# Altium schematic sheet 14-TestFixture.SchDoc: Test Fixture
size A2; Date: 26/12/2023; DocumentNumber: 14; SheetNumber: 14; SheetTotal: 15; SPICEModelCacheUDWTZYBE: <root> / <DocumentId>UDWTZYBE</DocumentId> / </root>
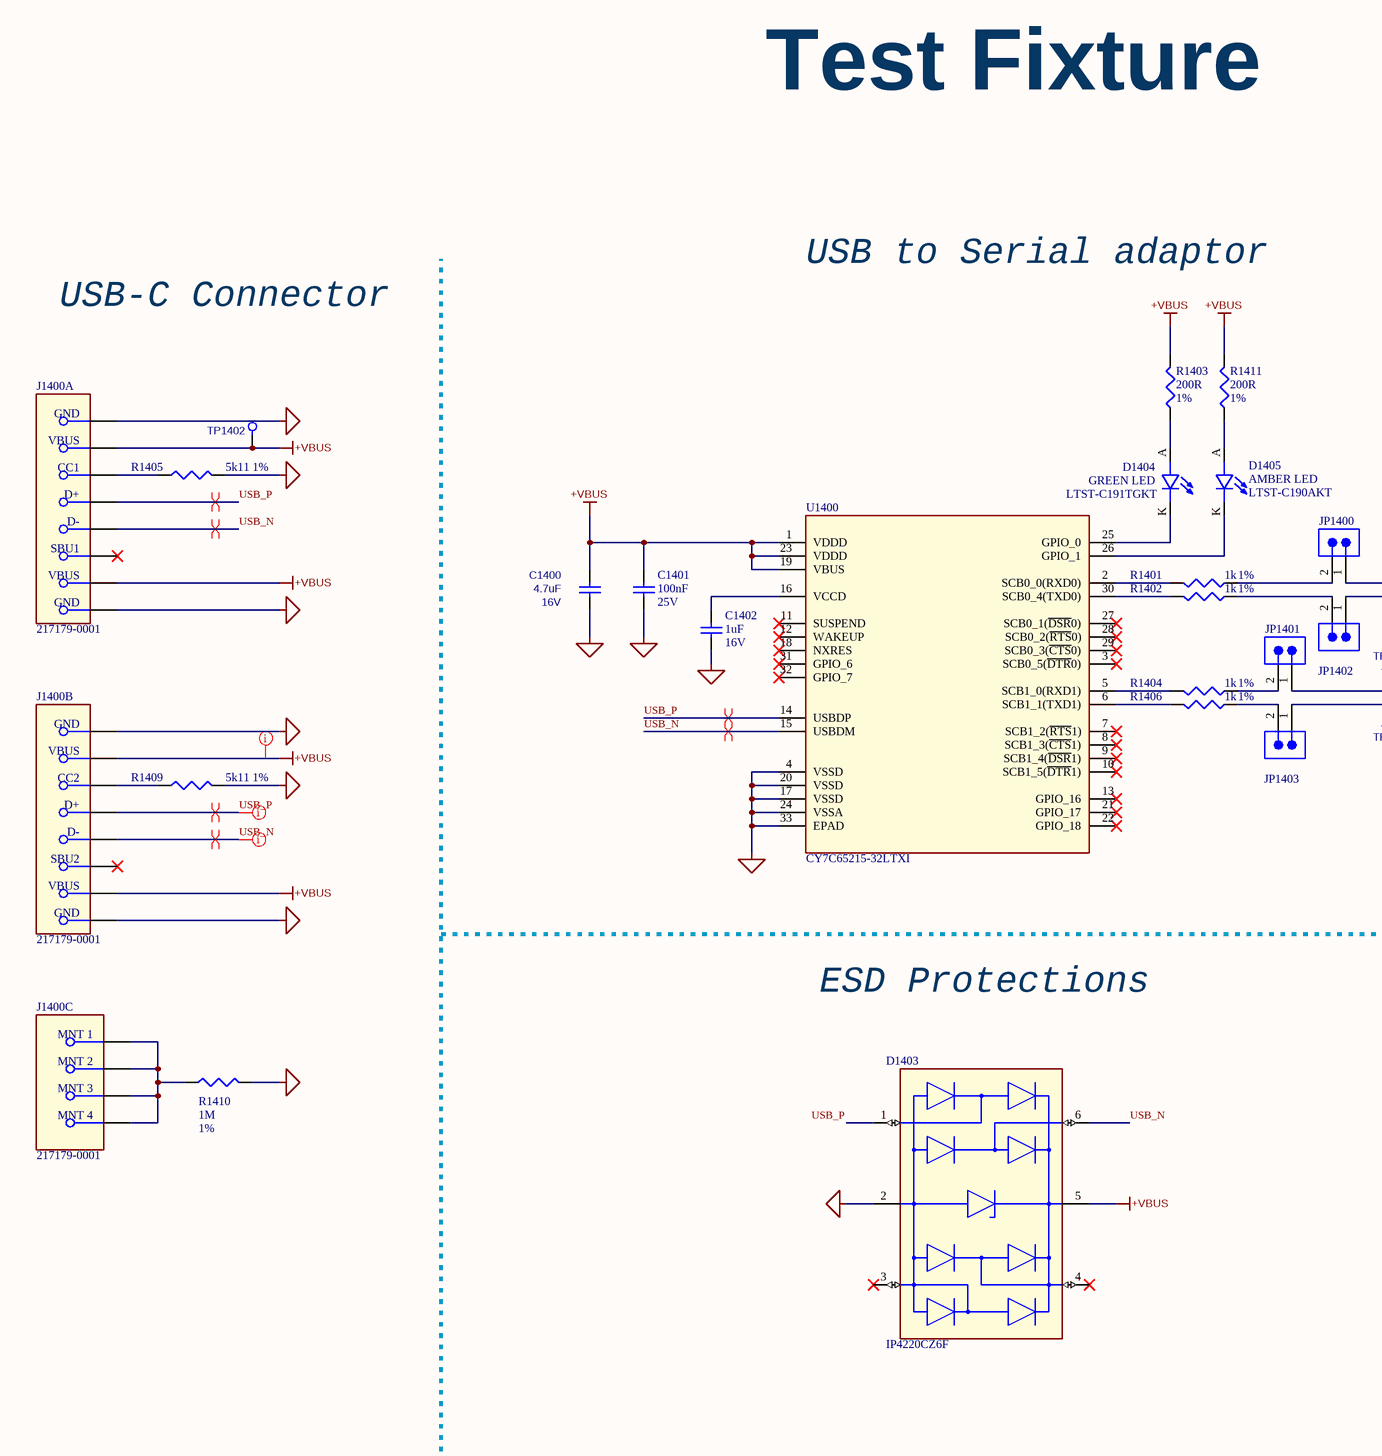
[diagram p0: 14-TestFixture.SchDoc, left]
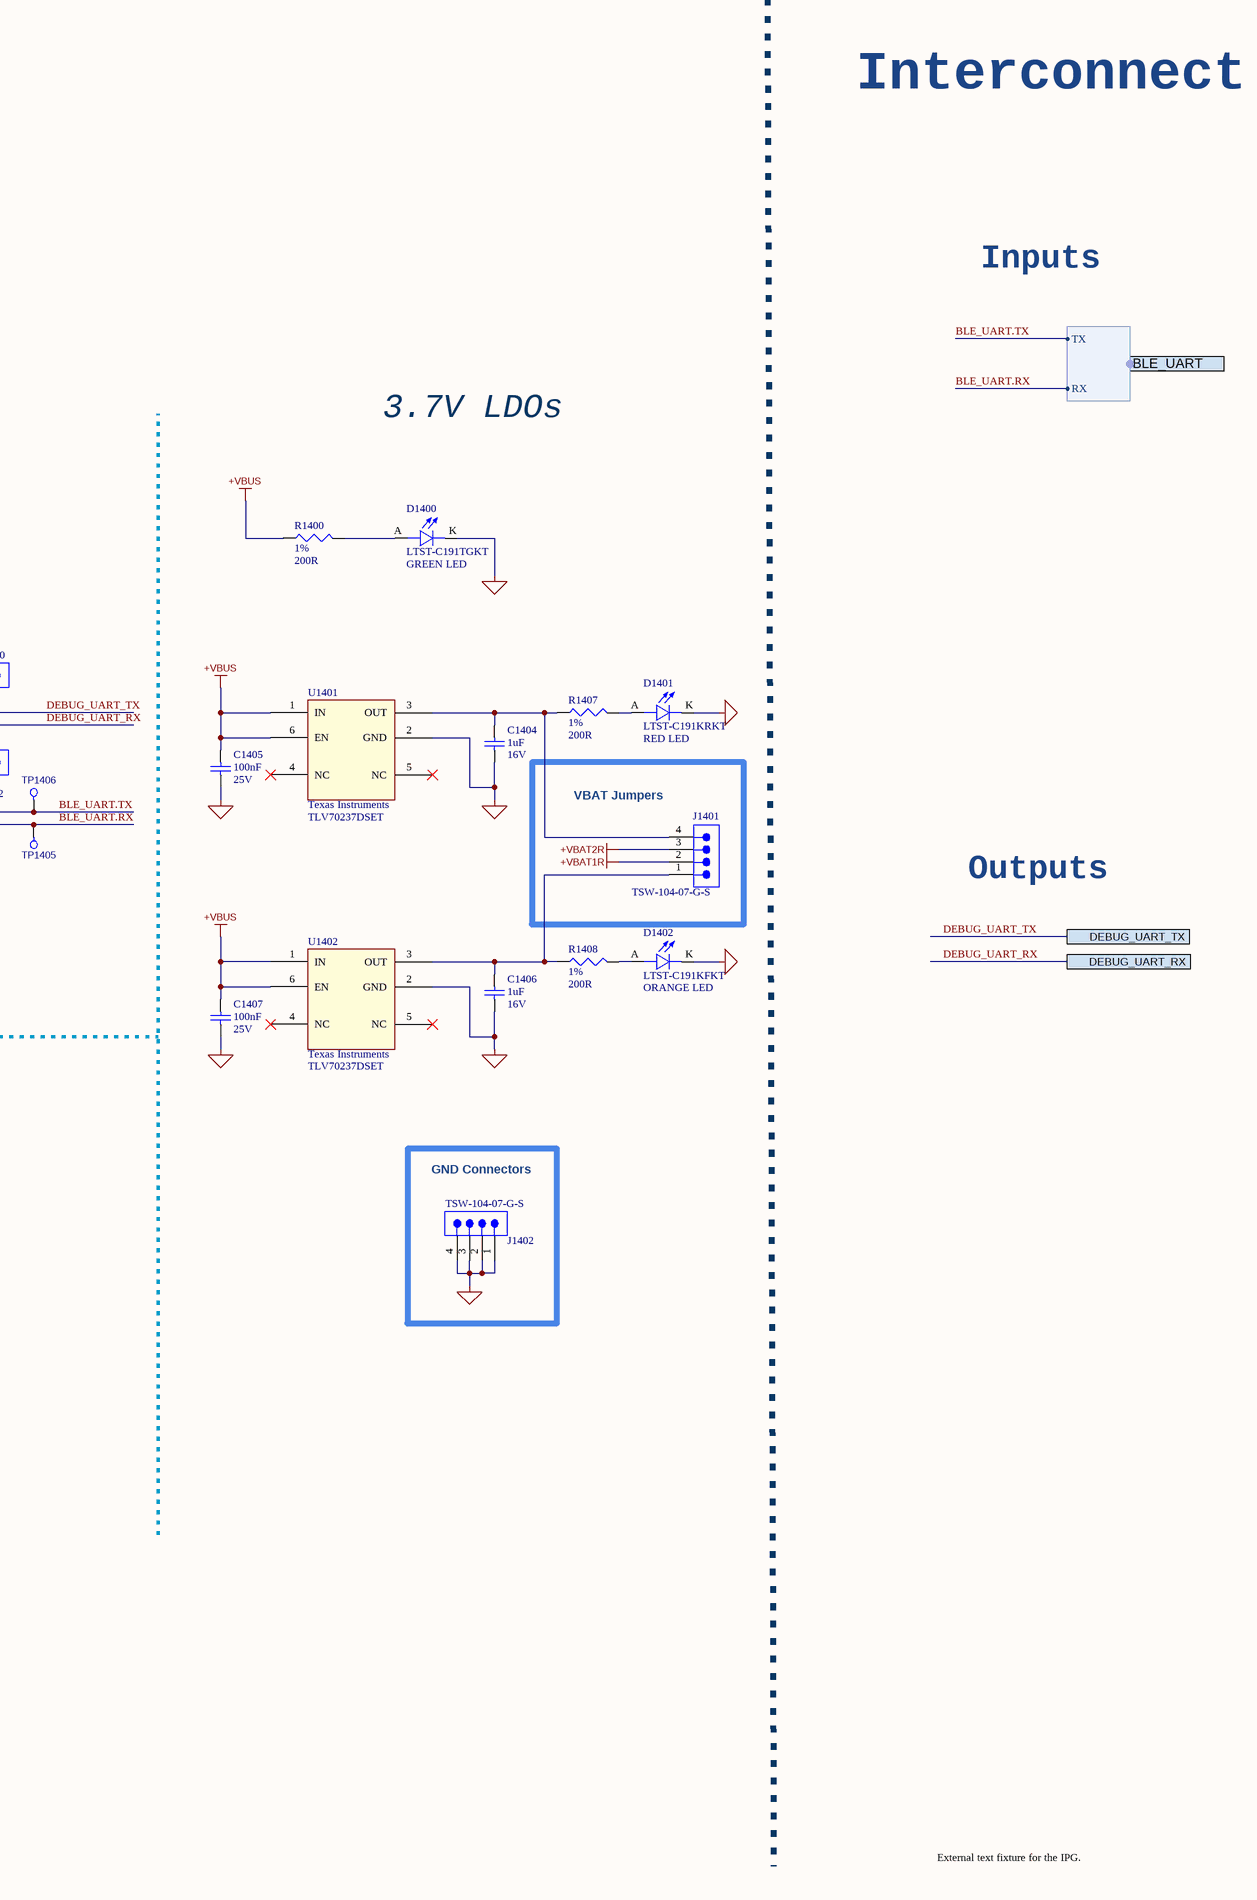
[diagram p1: 14-TestFixture.SchDoc, right]

## Parts
C1400  value 4.7uF  Rating: 16V  [CAP0603_REDUCED]  (hidden comment: GRM188R61C475KE11)
C1401  value 100nF  Rated DC Voltage (URdc): 25V  [C0201_C]  (hidden comment: GRM033R61E104KE14J)
C1402  value 1uF  Rated DC Voltage (URdc): 16V  [C0201_C]  (hidden comment: GRM033R61C105ME15D)
C1404  value 1uF  Rated DC Voltage (URdc): 16V  [C0201_C]  (hidden comment: GRM033R61C105ME15D)
C1405  value 100nF  Rated DC Voltage (URdc): 25V  [C0201_C]  (hidden comment: GRM033R61E104KE14J)
C1406  value 1uF  Rated DC Voltage (URdc): 16V  [C0201_C]  (hidden comment: GRM033R61C105ME15D)
C1407  value 100nF  Rated DC Voltage (URdc): 25V  [C0201_C]  (hidden comment: GRM033R61E104KE14J)
D1400  LTST-C191TGKT  value GREEN LED  [LEDC0603]
D1401  LTST-C191KRKT  value RED LED  [LEDC0603]
D1402  LTST-C191KFKT  value ORANGE LED  [LEDC0603]
D1403  IP4220CZ6F  [FP-SOT457-IPC_A]
D1404  LTST-C191TGKT  value GREEN LED  [LEDC0603]
D1405  LTST-C190AKT  value AMBER LED  [LEDC0603]
J1400  217179-0001  [217179-0001]  (parts A,B,C of 3)
J1401  TSW-104-07-G-S  [SMTC-TSW-104-07-X-S]
J1402  TSW-104-07-G-S  [SMTC-TSW-104-07-X-S]
JP1400  TSW-102-26-G-S  [SMTC-TSW-102-26-XX-S]  (value not drawn)
JP1401  TSW-102-26-G-S  [SMTC-TSW-102-26-XX-S]  (value not drawn)
JP1402  TSW-102-26-G-S  [SMTC-TSW-102-26-XX-S]  (value not drawn)
JP1403  TSW-102-26-G-S  [SMTC-TSW-102-26-XX-S]  (value not drawn)
R1400  value 200R  Tolerance: 1%  [RES0402_REDUCED]  (hidden comment: CRCW0402200RFKEDHP)
R1401  value 1k  Tolerance: 1%  [R0201_C]  (hidden comment: CRCW02011K00FNED)
R1402  value 1k  Tolerance: 1%  [R0201_C]  (hidden comment: CRCW02011K00FNED)
R1403  value 200R  Tolerance: 1%  [RES0402_REDUCED]  (hidden comment: CRCW0402200RFKEDHP)
R1404  value 1k  Tolerance: 1%  [R0201_C]  (hidden comment: CRCW02011K00FNED)
R1405  value 5k11  Tolerance: 1%  [R0201_C]  (hidden comment: CRCW02015K11FNED)
R1406  value 1k  Tolerance: 1%  [R0201_C]  (hidden comment: CRCW02011K00FNED)
R1407  value 200R  Tolerance: 1%  [RES0402_REDUCED]  (hidden comment: CRCW0402200RFKEDHP)
R1408  value 200R  Tolerance: 1%  [RES0402_REDUCED]  (hidden comment: CRCW0402200RFKEDHP)
R1409  value 5k11  Tolerance: 1%  [R0201_C]  (hidden comment: CRCW02015K11FNED)
R1410  value 1M  Tolerance: 1%  [R0201_C]  (hidden comment: CRCW02011M00FNED)
R1411  value 200R  Tolerance: 1%  [RES0402_REDUCED]  (hidden comment: CRCW0402200RFKEDHP)
TP1402  Test Point  [testpad_0.9mm]  (value not drawn)  (no BOM)
TP1405  Test Point  [testpad_0.9mm]  (value not drawn)  (no BOM)
TP1406  Test Point  [testpad_0.9mm]  (value not drawn)  (no BOM)
U1400  CY7C65215-32LTXI  [PG-VQFN-32-803]
U1401  Manufacturer: Texas Instruments  [SON127P600-8N]  (hidden comment: TLV70237DSET)
U1402  Manufacturer: Texas Instruments  [SON127P600-8N]  (hidden comment: TLV70237DSET)

## Ports
BLE_UART (harness UART), DEBUG_UART_RX, DEBUG_UART_TX

## Harnesses
UART: TX, RX

## Nets
+VBAT1R: J1401.2
+VBAT2R: J1401.3
+VBUS: C1400.1 C1401.2 C1405.2 C1407.2 D1403.5(VP) J1400.A4(VBUS) J1400.A9(VBUS) J1400.B4(VBUS) J1400.B9(VBUS) R1400.1 R1403.2 R1411.2 TP1402.1 U1400.1(VDDD) U1400.19(VBUS) U1400.23(VDDD) U1401.1(IN) U1401.6(EN) U1402.1(IN) U1402.6(EN)
GND: C1400.2 C1401.1 C1402.1 C1404.2 C1405.1 C1406.1 C1407.1 D1400.K D1401.K D1402.K D1403.2(GND) J1400.A1(GND) J1400.A12(GND) J1400.B1(GND) J1400.B12(GND) J1402.1 J1402.2 J1402.3 J1402.4 R1405.2 R1409.2 R1410.2 U1400.4(VSSD) U1400.17(VSSD) U1400.20(VSSD) U1400.24(VSSA) U1400.33(EPAD) U1401.2(GND) U1402.2(GND)
BLE_UART.RX: JP1403.1 TP1405.1 ; port BLE_UART.RX
BLE_UART.TX: JP1401.1 TP1406.1 ; port BLE_UART.TX
DEBUG_UART_RX: JP1402.1 ; port DEBUG_UART_RX
DEBUG_UART_TX: JP1400.1 ; port DEBUG_UART_TX
USB_N: D1403.6(I/O4) J1400.A7(D-) J1400.B7(D-) U1400.15(USBDM)
USB_P: D1403.1(I/O1) J1400.A6(D+) J1400.B6(D+) U1400.14(USBDP)
NetC1402_2: C1402.2 U1400.16(VCCD)
NetC1404_1: C1404.1 J1401.4 R1407.1 U1401.3(OUT)
NetC1406_2: C1406.2 J1401.1 R1408.1 U1402.3(OUT)
NetD1400_A: D1400.A R1400.2
NetD1401_A: D1401.A R1407.2
NetD1402_A: D1402.A R1408.2
NetD1404_A: D1404.A R1403.1
NetD1404_K: D1404.K U1400.25(GPIO_0)
NetD1405_A: D1405.A R1411.1
NetD1405_K: D1405.K U1400.26(GPIO_1)
NetJ1400_1: J1400.1(MNT_1) J1400.2(MNT_2) J1400.3(MNT_3) J1400.4(MNT_4) R1410.1
NetJ1400_A5: J1400.A5(CC1) R1405.1
NetJ1400_B5: J1400.B5(CC2) R1409.1
NetJP1400_2: JP1400.2 R1401.1
NetJP1401_2: JP1401.2 R1404.1
NetJP1402_2: JP1402.2 R1402.1
NetJP1403_2: JP1403.2 R1406.1
NetR1401_2: R1401.2 U1400.2(SCB0_0(RXD0))
NetR1402_2: R1402.2 U1400.30(SCB0_4(TXD0))
NetR1404_2: R1404.2 U1400.5(SCB1_0(RXD1))
NetR1406_2: R1406.2 U1400.6(SCB1_1(TXD1))

Not connected (* = marked no-connect by the designer): D1403 3(I/O2)* 4(I/O3)*; J1400 A8(SBU1)* B8(SBU2)*; U1400 3(SCB0_5(~{DTR}0))* 7(SCB1_2(~{RTS}1))* 8(SCB1_3(~{CTS}1))* 9(SCB1_4(~{DSR}1))* 10(SCB1_5(~{DTR}1))* 11(SUSPEND)* 12(WAKEUP)* 13(GPIO_16)* 18(NXRES)* 21(GPIO_17)* 22(GPIO_18)* 27(SCB0_1(~{DSR}0))* 28(SCB0_2(~{RTS}0))* 29(SCB0_3(~{CTS}0))* 31(GPIO_6)* 32(GPIO_7)*; U1401 4(NC)* 5(NC)*; U1402 4(NC)* 5(NC)*

## Layout directives
differential pair: USB_N, USB_P
net class DIGITAL: USB_N, USB_P
rule Supply Nets [Voltage = 5.000]: +VBUS

## Notes on the sheet
- Interconnect
- Test Fixture
- Inputs
- USB to Serial adaptor
- 3.7V LDOs
- USB-C Connector
- (near J1401) VBAT Jumpers
- Outputs
- ESD Protections
- GND Connectors
- External text fixture for the IPG.
- Project:
- Schematic:
- Design by:
- Date:
- Ver:
- .
- Comments:
- Reviewed by:

## Library data of the parts
C1400 = GRM188R61C475KE11: Capacitor, 4.7uF, X5R, 16V, 10%, 0603, Implant-grade; Manufacturer: Murata; Medical Grade MFR PN: GCH188R61C475KE11; Length (mm): 1.60 ±0.10; Medical Grade MFR: Murata; PCB Footprint: cap0603_reduced; Thickness (mm): 0.80 ±0.10; Width (mm): 0.80 ±0.10; Category: Capacitor; Package Description: 0603; Check: *; Supplier 1: Arrow Electronics; Supplier Part Number 1: GRM188R61C475KE11D; Status: *; Review: *; Manufacturer Part Number: GRM188R61C475KE11
C1401 C1405 C1407 = GRM033R61E104KE14J: Ceramic Capacitor, Multilayer, Ceramic, 25V, 10% +Tol, 10% -Tol, X5R, 15% TC, 0.1uF, Surface Mount, 0201; Manufacturer: Murata; Multilayer: Yes; Category: Ceramic Capacitors; Supplier: Digikey; Supplier Part Number: 490-14571-1-ND; Manufacturer Part Number: GRM033R61E104KE14J; RoHS: Yes; Stock: 1540851; Pricing: 1=0,1, 10=0,033, 50=0,0192, 100=0,0148, 500=0,01118, 1000=0,00878, 2500=0,00798, 5000=0,00734 (USD); Mounting Technology: Surface Mount; Pins: 2; Dielectric Material: Ceramic; Package Shape: Rectangular; Case/Package: 0201; Terminal Finish: Nickel; Min Operating Temperature: -55°C; Max Operating Temperature: 85°C; JESD-609 Code: e3; Capacitor Type: Ceramic; Tolerance  (fill in as +-): 10%; Package Style: SMTMeter; Packaging: Tape and Reel; Tolerance (fill in as +-): 10%; Temperature Characteristics Code: X5R; Termination: Wraparound; Length: 0.6mm; Width: 0.3mm; Height: 0.3mm; Reach SVHC Compliant: Yes; RoHS Compliant: Yes; ComponentLink1URL: https://psearch.en.murata.com:443/capacitor/product/GRM033R61E104KE14%23.pdf?src-supplier=IHS+Markit; ComponentLink1Description: https://psearch.en.murata.com:443/capacitor/product/GRM033R61E104KE14%23.pdf?src-supplier=IHS+Markit; ComponentLink2URL: http://www.mouser.com/ds/2/281/c02e-2905.pdf?src-supplier=Mouser; ComponentLink2Description: http://www.mouser.com/ds/2/281/c02e-2905.pdf?src-supplier=Mouser; ComponentLink3URL: http://search.murata.co.jp/Ceramy/image/img/A01X/G101/ENG/GRM033R61E104KE14-01.pdf?src-supplier=Digikey; ComponentLink3Description: http://search.murata.co.jp/Ceramy/image/img/A01X/G101/ENG/GRM033R61E104KE14-01.pdf?src-supplier=Digikey; ComponentLink4URL: https://search.murata.co.jp/Ceramy/image/img/A01X/G101/ENG/GRM033R61E104KE14-01.pdf?src-supplier=Digikey; ComponentLink4Description: https://search.murata.co.jp/Ceramy/image/img/A01X/G101/ENG/GRM033R61E104KE14-01.pdf?src-supplier=Digikey; Supplier 1: Arrow Electronics; Supplier Part Number 1: GRM033R61E104KE14J
C1402 C1404 C1406 = GRM033R61C105ME15D: Ceramic Capacitor, Multilayer, Ceramic, 16V, 20% +Tol, 20% -Tol, X5R, 15% TC, 1uF, Surface Mount, 0201; Manufacturer: Murata; Supplier: Digikey; Supplier Part Number: 490-18654-1-ND; Manufacturer Part Number: GRM033R61C105ME15D; RoHS: No; Category: Ceramic Capacitors; Stock: 132893; Pricing: 1=0,16, 10=0,105, 50=0,0628, 100=0,0493, 500=0,03644, 1000=0,03017, 2500=0,02808, 5000=0,02569 (USD); Supplier 1: Avnet; Supplier Part Number 1: GRM033R61C105ME15D
D1400 D1404 = LED GREEN CLEAR SMD 0603: LED, GREEN, SMD, 0603, 3.2V, 20mA; Manufacturer: Lite-On Inc.; Power Rating: 76mW; Wavelength: 525nm; Category: LED; Manufacturer Part Number: LTST-C191TGKT; Size Code: 0603; Supplier: Digi-Key; Supplier Part Number: 160-1888-2-ND; Height: 0.55mm; Width: 0.80mm; Length: 1.60mm; Forward Voltage: 3.2V; Forward Current: 20mA; Supplier 1: Digikey; Supplier Part Number 1: 160-1888-2-ND
D1401 = LED RED CLEAR SMD 0603: LED, RED, SMD, 0603, 2V, 30mA; Manufacturer: Lite-On Inc.; Power Rating: 75mW; Wavelength: 631nm; Category: LED; Manufacturer Part Number: LTST-C191KRKT; Size Code: 0603; Supplier: Digi-Key; Supplier Part Number: 160-1447-2-ND; Height: 0.55mm; Width: 0.80mm; Length: 1.60mm; Forward Voltage: 2V; Forward Current: 30mA; Supplier 1: Digikey; Supplier Part Number 1: 160-1447-2-ND
D1402 = LED ORANGE CLEAR SMD 0603: LED, ORANGE, SMD, 0603, 2V, 30mA; Manufacturer: Lite-On Inc.; Power Rating: 75mW; Wavelength: 605nm; Category: LED; Manufacturer Part Number: LTST-C191KFKT; Size Code: 0603; Supplier: Digi-Key; Supplier Part Number: 160-1445-2-ND; Height: 0.55mm; Width: 0.80mm; Length: 1.60mm; Forward Voltage: 2V; Forward Current: 30mA; Supplier 1: Digikey; Supplier Part Number 1: 160-1445-2-ND
D1403 = IP4220CZ6F: TVS DIODE 5.5VWM 6TSOP; Manufacturer: Nexperia; RoHS Compliant: Yes; Manufacturer Part Number: IP4220CZ6F; Supplier 1: Digikey; Supplier Part Number 1: 1727-2751-1-ND
D1405 = LTST-C190AKT: LED, Amber, SMD, 0603, 2.1 V, 30 mA; Manufacturer: Lite-On; Forward Voltage: 2.1V; Forward Current: 30mA; Power Rating: 100 mW; Wavelength: 602 nm; Category: LED; Manufacturer Part Number: LTST-C190AKT; Size Code: 0603; Height: 0.55 mm; Width: 0.8 mm; Length: 1.6 mm; Supplier 1: Mouser; Supplier Part Number 1: 859-LTST-C190AKT
J1400 = 217179-0001: CONN RCP USB2.0 TYP C 16P SMD RA; pin to pad: B1>A12 B4>A9 B9>A4 B12>A1; Manufacturer: Molex; Number Of Contacts: 16; Voltage Rating: 30V; Shielding: true; Current Rating: 0.25/1.25/5A; Conn Orientation: Right Angle; Contact Material: Gold,Nickel; ComponentLink2Description: Datasheet; RoHS: TRUE; ComponentLink2URL: https://www.molex.com/webdocs/datasheets/pdf/en-us/1054500101_IO_CONNECTORS.pdf; Temperature: -30°C to +85°C; Usb Standard: USB 2.0; Manufacturer Part Number: 217179-0001; Supplier 1: Mouser; Supplier Part Number 1: 538-217179-0001
J1401 J1402 = TSW-104-07-G-S: Board Connector, 4 Contact(s), 1 Row(s), Male, Straight, 0.1 inch Pitch, Solder Terminal, Black Insulator, Receptacle; Manufacturer: Samtec; PartNumber: TSW-106-07-G-S; Pitch: 2.54 mm; Option: General Purpose; Filter Feature: No; Number of Rows Loaded: 1; Number of Contacts: 4; Additional Feature: E.L.P.; Contact Pattern: RECTANGULAR; Contact Style: SQ PIN-SKT; Mating Information: MULTIPLE MATING PARTS AVAILABLE; Plating Thickness: 10uin; Reference Standard: UL; Reliability: COMMERCIAL; RoHS: True; ComponentLink1Description: Manufacturer URL; DatasheetVersion: F-214; Orientation: Vertical; ComponentLink1URL: http://www.samtec.com; ComponentLink3Description: Package Specification; ComponentLink2Description: Datasheet; PackageVersion: DM, 8/1988; PackageDescription: .025[0.64] SQ. Post Terminal Strip Assembly; PackageReference: TSW-106-07-X-S; Mounting Technology: Through-hole; Temperature Range: -55 to 125 degC; ComponentLink3URL: http://www.samtec.com/documents/webfiles/cpdf/TSW-XXX-XX-XXX-X-XX-XXX-MKT.pdf; ComponentLink2URL: http://www.samtec.com/documents/webfiles/pdf/TSW_TH.PDF; Supplier: Arrow Electronics; Supplier Part Number: TSW-104-07-G-S; Manufacturer Part Number: TSW-104-07-G-S; Category: Board to Board Connectors; Stock: 5100; Pricing: 1=0,59, 50=0,46, 100=0,37, 500=0,32, 1000=0,24, 2000=0,21, 5000=0,15 (USD); Contact Finish - Termination: Gold (Au) - with Nickel (Ni) barrier; Contact Material: Bronze; Contact Finish - Mating: GOLD (10) OVER NICKEL (50); Insulation Color: Black; Insulation Material: Glass; Connector Type: BOARD CONNECTOR; JESD-609 Code: e4; Contact Gender: Male; Mixed Contacts: No; Mounting Style: STRAIGHT; Termination: Solder; Number Of Connectors: 1; Number Of PCB Rows: 1; PCB Contact Pattern: RECTANGULAR; Body/Shell Style: RECEPTACLE; Terminal Pitch: 2.54mm; Mating Contact Pitch: 0.1inch; Body Breadth: 0.1inch; Body Depth: 0.1inch; Terminal Length: 0.1inch; Flammability Rating: UL94 V-0; DIN Conformance: No; IEC Conformance: No; MIL Conformance: No; Reach SVHC Compliant: Yes; RoHS Compliant: Yes; ComponentLink4URL: https://datasheet.ciiva.com:443/pdfs/VipMasterIC/IC/SAMI/SAMI-S-A0003531373/SAMI-S-A0003531373-1.pdf?src-supplier=IHS+Markit; ComponentLink4Description: https://datasheet.ciiva.com:443/pdfs/VipMasterIC/IC/SAMI/SAMI-S-A0003531373/SAMI-S-A0003531373-1.pdf?src-supplier=IHS+Markit; ComponentLink5URL: https://datasheet.ciiva.com/6889/tsw-xxx-xx-xxx-x-xx-xxx-mkt-6889291.pdf?src-supplier=Digi-Key; ComponentLink5Description: https://datasheet.ciiva.com/6889/tsw-xxx-xx-xxx-x-xx-xxx-mkt-6889291.pdf?src-supplier=Digi-Key; Supplier 1: Digikey; Supplier Part Number 1: SAM1029-04-ND
JP1400-JP1403 = TSW-102-26-G-S: Conn Unshrouded Header HDR 2 POS 2.54mm Solder ST Thru-Hole; Manufacturer: Samtec; Number of Contacts: 2; Gender: Male; Max Current Rating: 7.6A; Max Voltage Rating (AC): 550V; Orientation: Vertical; ComponentLink3Description: Package Specification; PackageReference: TSW-102-26-XX-S; Mounting Technology: Through-hole; ComponentLink2Description: Datasheet; ComponentLink1URL: http://www.samtec.com; DatasheetVersion: F-214; ComponentLink1Description: Manufacturer URL; RoHS: True; ComponentLink2URL: http://www.samtec.com/documents/webfiles/pdf/TSW_TH.PDF; PartNumber: TSW-102-26-G-S; ComponentLink3URL: http://www.samtec.com/documents/webfiles/cpdf/TSW-XXX-XX-XXX-X-XX-XXX-MKT.pdf; Pitch: 2.54 mm; PackageDescription: .025[0.64] SQ. Post Terminal Strip Assembly; PackageVersion: DM, 8/1988; Temperature Range: -55 to 125 degC; Supplier: Newark; Supplier Part Number: 12P1301; Manufacturer Part Number: TSW-102-26-G-S; Category: Connectors; Stock: 3117; Pricing: 1=0.51000, 10=0.47500, 100=0.33200, 500=0.28400, 1000=0.23700, 2500=0.21000, 5000=0.20400 (USD); Contact Plating: Gold; Contact Material: Bronze; Color: Black; Housing Material: Polyester; Contact Shape: Square; Contact Finish - Mating: GOLD; Insulation Color: Black; Insulation Material: PBT; Housing Color: Black; Min Operating Temperature: -55°C; Max Operating Temperature: 125°C; Number of Rows: 1; Packaging: Bulk; Termination: Solder; Number of Positions: 2; Connector Type: Header; Series: TSW; Contact Type: Male Pin; Fastening Type: Pull; Package Quantity: 1; Length: 5.08mm; Width: 2.54mm; Contact Mating Length: 0.23inch; Depth: 2.54mm; Radiation Hardening: No; RoHS Compliant: Yes; Flammability Rating: UL94 V-0; Lead Free: Lead Free; Reach SVHC Compliant: Yes; ComponentLink4URL: https://datasheet.ciiva.com/10281/htsw-th-10281416.pdf?src-supplier=Avnet; ComponentLink4Description: https://datasheet.ciiva.com/10281/htsw-th-10281416.pdf?src-supplier=Avnet; ComponentLink5URL: https://datasheet.ciiva.com/6887/tsw-xxx-xx-xxx-x-xx-xxx-mkt-6887237.pdf?src-supplier=Digi-Key; ComponentLink5Description: https://datasheet.ciiva.com/6887/tsw-xxx-xx-xxx-x-xx-xxx-mkt-6887237.pdf?src-supplier=Digi-Key; Supplier 1: Digikey; Supplier Part Number 1: SAM1077-02-ND
R1400 R1403 R1407 R1408 R1411 = CRCW0402200RFKEDHP: Resistor 200 1%, 0402, Non Implant-grade; Manufacturer: Vishay; Medical Grade Manufacturer: None; Power: 200 mW; Temperature Coefficient: 100 ppm/°C; Voltage Rating: 50V; Category: Resistor; Manufacturer Part Number: CRCW0402200RFKEDHP; Medical Grade Manufacturer Part Number: None; Size Code: 0402; Supplier: TBD; Supplier Part Number: TBD; Height: 0.3mm; Width: 0.5mm; Length: 1mm; Supplier 1: Mouser; Supplier Part Number 1: 71-CRCW0402200RFKEDH; Supplier 2: Digikey; Supplier Part Number 2: 541-200YCT-ND; Supplier 3: Digikey; Supplier Part Number 3: 541-200YDKR-ND; Supplier 4: Digikey; Supplier Part Number 4: 541-200YTR-ND
R1401 R1402 R1404 R1406 = CRCW02011K00FNED: Fixed Resistor, Metal Glaze/thick Film, 0.05W, 1000ohm, 30V, 1% +/-Tol, 200ppm/Cel, Surface Mount, 0201; Manufacturer: Vishay; Medical Grade MFR: Mini-Systems; Medical Grade MFR PN: MWA96SM-1001F-NS62TR; Power: 50mW; Rated Temperature: 70°C; Temperature Coefficient: 200ppm/°C; Package Height: 0.23mm; Package Length: 0.6mm; Package Width: 0.3mm; Reference Standard: AEC-Q200; Category: Chip SMD Resistors; Supplier: Digikey; Supplier Part Number: 541-1.00KABCT-ND; Manufacturer Part Number: CRCW02011K00FNED; RoHS: Yes; Stock: 303224; Pricing: 1=0,1, 10=0,037, 50=0,0242, 100=0,0204, 500=0,01426, 1000=0,01241, 5000=0,00924 (USD); Mounting Technology: Surface Mount; Pins: 2; Package Shape: Rectangular; Case/Package: 0201; Terminal Finish: Nickel; Min Operating Temperature: -55°C; Max Operating Temperature: 155°C; JESD-609 Code: e3; Resistor Type: FIXED RESISTOR; Construction: Chip; Package Style: SMTMeter; Packaging: Tape and Reel; Technology: METAL GLAZE/THICK FILM; Termination: Wraparound; Working Voltage: 30V; Reach SVHC Compliant: Yes; RoHS Compliant: Yes; ComponentLink1URL: https://datasheet.ciiva.com:443/pdfs/VipMasterIC/IC/VISH/VISH-S-A0002932828/VISH-S-A0002932828-1.pdf?src-supplier=IHS+Markit; ComponentLink1Description: https://datasheet.ciiva.com:443/pdfs/VipMasterIC/IC/VISH/VISH-S-A0002932828/VISH-S-A0002932828-1.pdf?src-supplier=IHS+Markit; ComponentLink2URL: https://datasheet.ciiva.com/7983/1719906-7983324.pdf?src-supplier=Element14; ComponentLink2Description: https://datasheet.ciiva.com/7983/1719906-7983324.pdf?src-supplier=Element14; ComponentLink3URL: https://datasheet.ciiva.com/7983/1719906-7983323.pdf?src-supplier=Element14; ComponentLink3Description: https://datasheet.ciiva.com/7983/1719906-7983323.pdf?src-supplier=Element14; ComponentLink4URL: https://datasheet.ciiva.com/22692/1719906-22692751.pdf?src-supplier=Element14; ComponentLink4Description: https://datasheet.ciiva.com/22692/1719906-22692751.pdf?src-supplier=Element14; ComponentLink5URL: https://datasheet.ciiva.com/22665/1825492-22665818.pdf?src-supplier=Element14; ComponentLink5Description: https://datasheet.ciiva.com/22665/1825492-22665818.pdf?src-supplier=Element14; ComponentLink6URL: https://datasheet.ciiva.com/2474/crcw0201e3-2474801.pdf?src-supplier=Digikey; ComponentLink6Description: https://datasheet.ciiva.com/2474/crcw0201e3-2474801.pdf?src-supplier=Digikey; ComponentLink7URL: https://datasheet.ciiva.com/2474/crcw0201e3-2474802.pdf?src-supplier=Digikey; ComponentLink7Description: https://datasheet.ciiva.com/2474/crcw0201e3-2474802.pdf?src-supplier=Digikey; ComponentLink8URL: https://datasheet.ciiva.com/2474/crcw0201e3-2474800.pdf?src-supplier=Digikey; ComponentLink8Description: https://datasheet.ciiva.com/2474/crcw0201e3-2474800.pdf?src-supplier=Digikey; ComponentLink9URL: https://datasheet.ciiva.com/22871/70202042-22871422.pdf?src-supplier=Allied+Electronics; ComponentLink9Description: https://datasheet.ciiva.com/22871/70202042-22871422.pdf?src-supplier=Allied+Electronics; ComponentLink10URL: https://datasheet.ciiva.com/3255/crcw0201e3-3255929.pdf?src-supplier=Avnet; ComponentLink10Description: https://datasheet.ciiva.com/3255/crcw0201e3-3255929.pdf?src-supplier=Avnet; Supplier 1: Arrow Electronics; Supplier Part Number 1: CRCW02011K00FNED
R1405 R1409 = CRCW02015K11FNED: Fixed Resistor, Metal Glaze/thick Film, 0.05W, 5110ohm, 30V, 1% +/-Tol, 200ppm/Cel, Surface Mount, 0201; Manufacturer: Vishay; Medical Grade MFR: Mini-Systems; Medical Grade MFR PN: MWA96SM-5111F-NS62TR; Temperature Coefficient: 200ppm/°C; Power: 50mW; Rated Temperature: 70°C; Package Height: 0.23mm; Package Length: 0.6mm; Package Width: 0.3mm; Reference Standard: AEC-Q200; Packaging: Tape and Reel; Termination: Wraparound; Max Operating Temperature: 155°C; Case/Package: 0201; Min Operating Temperature: -55°C; Supplier: Digikey; Supplier Part Number: 541-CRCW02015K11FNEDCT-ND; Manufacturer Part Number: CRCW02015K11FNED; RoHS: Yes; Category: Chip SMD Resistors; Stock: 23740; Pricing: 1=0,1, 10=0,037, 50=0,0242, 100=0,0204, 500=0,01426, 1000=0,01241, 5000=0,00924 (USD); Mounting Technology: Surface Mount; Pins: 2; Package Shape: Rectangular; Terminal Finish: Nickel; JESD-609 Code: e3; Resistor Type: FIXED RESISTOR; Construction: Chip; Package Style: SMTMeter; Technology: METAL GLAZE/THICK FILM; Working Voltage: 30V; Reach SVHC Compliant: Yes; RoHS Compliant: Yes; ComponentLink1URL: https://datasheet.ciiva.com:443/pdfs/VipMasterIC/IC/VISH/VISH-S-A0002932828/VISH-S-A0002932828-1.pdf?src-supplier=IHS+Markit; ComponentLink1Description: https://datasheet.ciiva.com:443/pdfs/VipMasterIC/IC/VISH/VISH-S-A0002932828/VISH-S-A0002932828-1.pdf?src-supplier=IHS+Markit; ComponentLink2URL: https://datasheet.ciiva.com/2577/crcw0201e3-2577232.pdf?src-supplier=Digikey; ComponentLink2Description: https://datasheet.ciiva.com/2577/crcw0201e3-2577232.pdf?src-supplier=Digikey; ComponentLink3URL: https://datasheet.ciiva.com/9067/crcw0201e3-9067501.pdf?src-supplier=Avnet; ComponentLink3Description: https://datasheet.ciiva.com/9067/crcw0201e3-9067501.pdf?src-supplier=Avnet; ComponentLink4URL: https://datasheet.ciiva.com/22707/1719906-22707711.pdf?src-supplier=Element14; ComponentLink4Description: https://datasheet.ciiva.com/22707/1719906-22707711.pdf?src-supplier=Element14; ComponentLink5URL: https://datasheet.ciiva.com/7690/1719906-7690629.pdf?src-supplier=Element14; ComponentLink5Description: https://datasheet.ciiva.com/7690/1719906-7690629.pdf?src-supplier=Element14; Supplier 1: Digikey; Supplier Part Number 1: 541-CRCW02015K11FNEDCT-ND
R1410 = CRCW02011M00FNED: Fixed Resistor, Metal Glaze/thick Film, 0.05W, 1000000ohm, 30V, 1% +/-Tol, 200ppm/Cel, Surface Mount, 0201; Manufacturer: Vishay; Medical Grade MFR: Mini-Systems; Medical Grade MFR PN: MWA96SM-1004F-NS62TR; Power: 50mW; Rated Temperature: 70°C; Temperature Coefficient: 200ppm/°C; Package Height: 0.23mm; Package Length: 0.6mm; Package Width: 0.3mm; Reference Standard: AEC-Q200; Category: Chip SMD Resistors; Supplier: Digikey; Supplier Part Number: 541-1.00MABCT-ND; Manufacturer Part Number: CRCW02011M00FNED; RoHS: Yes; Stock: 392914; Pricing: 1=0,1, 10=0,037, 50=0,0242, 100=0,0204, 500=0,01426, 1000=0,01241, 5000=0,00924 (USD); Mounting Technology: Surface Mount; Pins: 2; Package Shape: Rectangular; Case/Package: 0201; Terminal Finish: Nickel; Min Operating Temperature: -55°C; Max Operating Temperature: 155°C; JESD-609 Code: e3; Resistor Type: FIXED RESISTOR; Construction: Chip; Package Style: SMTMeter; Packaging: Tape and Reel; Technology: METAL GLAZE/THICK FILM; Termination: Wraparound; Working Voltage: 30V; Reach SVHC Compliant: Yes; RoHS Compliant: Yes; ComponentLink1URL: https://datasheet.ciiva.com:443/pdfs/VipMasterIC/IC/VISH/VISH-S-A0002932828/VISH-S-A0002932828-1.pdf?src-supplier=IHS+Markit; ComponentLink1Description: https://datasheet.ciiva.com:443/pdfs/VipMasterIC/IC/VISH/VISH-S-A0002932828/VISH-S-A0002932828-1.pdf?src-supplier=IHS+Markit; ComponentLink2URL: https://datasheet.ciiva.com/7841/1719906-7841438.pdf?src-supplier=Element14; ComponentLink2Description: https://datasheet.ciiva.com/7841/1719906-7841438.pdf?src-supplier=Element14; ComponentLink3URL: https://datasheet.ciiva.com/7841/1719906-7841439.pdf?src-supplier=Element14; ComponentLink3Description: https://datasheet.ciiva.com/7841/1719906-7841439.pdf?src-supplier=Element14; ComponentLink4URL: https://datasheet.ciiva.com/7859/dcrcwe3-7859689.pdf?src-supplier=Element14; ComponentLink4Description: https://datasheet.ciiva.com/7859/dcrcwe3-7859689.pdf?src-supplier=Element14; ComponentLink5URL: https://datasheet.ciiva.com/16757/70202042-16757675.pdf?src-supplier=Allied+Electronics; ComponentLink5Description: https://datasheet.ciiva.com/16757/70202042-16757675.pdf?src-supplier=Allied+Electronics; ComponentLink6URL: https://datasheet.ciiva.com/22692/1719906-22692761.pdf?src-supplier=Element14; ComponentLink6Description: https://datasheet.ciiva.com/22692/1719906-22692761.pdf?src-supplier=Element14; ComponentLink7URL: https://datasheet.ciiva.com/9109/crcw0201e3-9109910.pdf?src-supplier=Avnet; ComponentLink7Description: https://datasheet.ciiva.com/9109/crcw0201e3-9109910.pdf?src-supplier=Avnet; ComponentLink8URL: https://datasheet.ciiva.com/22675/1847332-22675065.pdf?src-supplier=Element14; ComponentLink8Description: https://datasheet.ciiva.com/22675/1847332-22675065.pdf?src-supplier=Element14; ComponentLink9URL: https://datasheet.ciiva.com/2474/crcw0201e3-2474824.pdf?src-supplier=Digikey; ComponentLink9Description: https://datasheet.ciiva.com/2474/crcw0201e3-2474824.pdf?src-supplier=Digikey; ComponentLink10URL: https://datasheet.ciiva.com/2474/crcw0201e3-2474825.pdf?src-supplier=Digikey; ComponentLink10Description: https://datasheet.ciiva.com/2474/crcw0201e3-2474825.pdf?src-supplier=Digikey; ComponentLink11URL: https://datasheet.ciiva.com/2474/crcw0201e3-2474826.pdf?src-supplier=Digikey; ComponentLink11Description: https://datasheet.ciiva.com/2474/crcw0201e3-2474826.pdf?src-supplier=Digikey; Supplier 1: Digikey; Supplier Part Number 1: 541-1.00MABCT-ND
TP1402 TP1405 TP1406 = Test Point: Test pad, 0.90mm circular pad; PCB Footprint: testpad_0p90mm; Length (mm): 0.90; Manufacturer: N/A; Manufacturer PN: N/A; Medical Grade MFR: N/A; Medical Grade MFR PN: N/A; Rating: N/A; Thickness (mm): N/A; Value: Test point; Width (mm): 0.90; Category: Test point; Status: *; Review: *
U1400 = CY7C65215-32LTXI: IC USB TO SERIAL BRIDGE 32QFN; Manufacturer: Infineon; Category: ICs; Type: USB to Serial Bridge; Manufacturer Part Number: CY7C65215-32LTXI; RoHS: Yes; Package: 32-QFN; Supplier 1: Digikey; Supplier Part Number 1: CY7C65215-32LTXI-ND
U1401 U1402 = TLV70237DSET: Fixed Positive LDO Regulator, 3.7V, 0.375V Dropout, PDSO6; Package Body Material: Plastic; Max Supply Voltage: 5.5V; Min Input Voltage: 2V; Channels: 1; Output Current1-Max: 300mA; Output Voltage1-Max: 3.774V; Output Voltage1-Min: 3.626V; Regulator Type: FIXED POSITIVE SINGLE OUTPUT LDO REGULATOR; Supplier: Digi-Key; RoHS: Yes; Category: Voltage Regulators - Linear; Stock: 1935; Pricing: 1=1,11, 10=0,992, 25=0,9416, 100=0,7736 (USD); Case/Package: VSON; Pins: 6; Package Shape: Square; Terminal Finish: Nickel; JESD-609 Code: e4; JESD-30 Code: S-PDSO-N6; Moisture Sensitivity Level: 1; Operating Temperature, TJ-Max: 125°C; Operating Temperature, TJ-Min: -40°C; Output Voltage1-Nom: 3.7V; Package Style: SMALL OUTLINE, VERY THIN PROFILEMeter; Peak Reflow Temperature (Cel): 260°C; Surface Mount: Yes; Terminal Form: No Lead; Terminal Position: DUAL; Length: 1.5mm; Width: 1.5mm; Height - Seated (Max): 0.8mm; Terminal Pitch: 0.5mm; Reach SVHC Compliant: Yes; RoHS Compliant: Yes; ComponentLink1URL: https://www.ti.com:443/lit/ds/symlink/tlv702.pdf?src-supplier=IHS+Markit; ComponentLink1Description: https://www.ti.com:443/lit/ds/symlink/tlv702.pdf?src-supplier=IHS+Markit; ComponentLink2URL: http://www.ti.com/lit/ds/symlink/tlv702.pdf?src-supplier=Digi-Key; ComponentLink2Description: http://www.ti.com/lit/ds/symlink/tlv702.pdf?src-supplier=Digi-Key; ComponentLink3URL: http://www.ti.com/lit/ds/symlink/tlv70237.pdf?src-supplier=Avnet; ComponentLink3Description: http://www.ti.com/lit/ds/symlink/tlv70237.pdf?src-supplier=Avnet; Supplier 1: Digi-Key; Supplier Part Number 1: 296-TLV70237DSETCT-ND; Supplier Part Number: 296-TLV70237DSETCT-ND; Manufacturer Part Number: TLV70237DSET